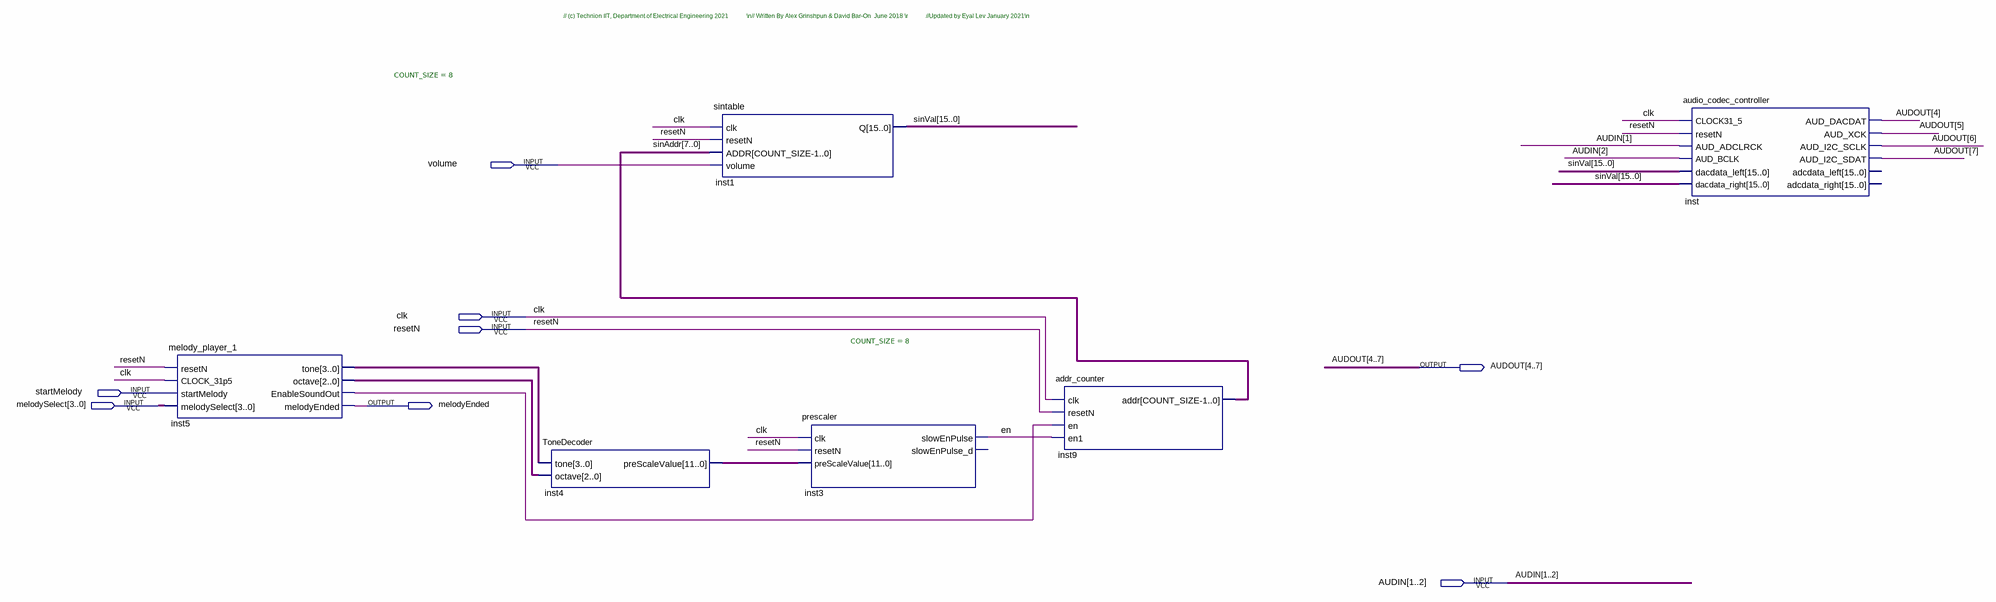
[diagram p0: schematic sheet]
// Quartus schematic AUDIO.bdf as structural Verilog: 6 symbols, 8 pins
module AUDIO (
  input  volume,
  input  clk,
  input  resetN,
  input  startMelody,
  input  [3:0] melodySelect,
  input  [1:2] AUDIN,
  output [4:7] AUDOUT,
  output melodyEnded
);

  wire en, inst5_enablesoundout;
  wire [2:0] inst5_octave;
  wire [3:0] inst5_tone;
  wire [7:0] sinAddr;
  wire [11:0] inst4_prescalevalue;
  wire [15:0] sinVal;

  melody_player_1 inst5 (
    .resetN(resetN), .CLOCK_31p5(clk), .startMelody(startMelody), .melodySelect(melodySelect),
    .tone(inst5_tone), .octave(inst5_octave), .EnableSoundOut(inst5_enablesoundout), .melodyEnded(melodyEnded));
  ToneDecoder inst4 (.tone(inst5_tone), .octave(inst5_octave), .preScaleValue(inst4_prescalevalue));
  sintable #(.COUNT_SIZE(8)) inst1 (.clk(clk), .resetN(resetN), .ADDR(sinAddr), .volume(volume), .Q(sinVal));
  prescaler inst3 (
    .clk(clk), .resetN(resetN), .preScaleValue(inst4_prescalevalue), .slowEnPulse(en));  // open: slowEnPulse_d
  addr_counter #(.COUNT_SIZE(8)) inst9 (
    .clk(clk), .resetN(resetN), .en(inst5_enablesoundout), .en1(en), .addr(sinAddr));
  audio_codec_controller inst (
    .CLOCK31_5(clk), .resetN(resetN), .AUD_ADCLRCK(AUDIN[1]), .AUD_BCLK(AUDIN[2]), .dacdata_left(sinVal),
    .dacdata_right(sinVal), .AUD_DACDAT(AUDOUT[4]), .AUD_XCK(AUDOUT[5]), .AUD_I2C_SCLK(AUDOUT[6]),
    .AUD_I2C_SDAT(AUDOUT[7]));  // open: adcdata_left, adcdata_right

  // Notes on the sheet:
  //   // (c) Technion IIT, Department of Electrical Engineering 2021            \n// Written By Alex Grinshpun & David Bar-On  June 2018 \r            //Updated by Eyal Lev January 2021\n
endmodule
